# EAGLE design 5uH_LISN (EAGLE 7.6.0)
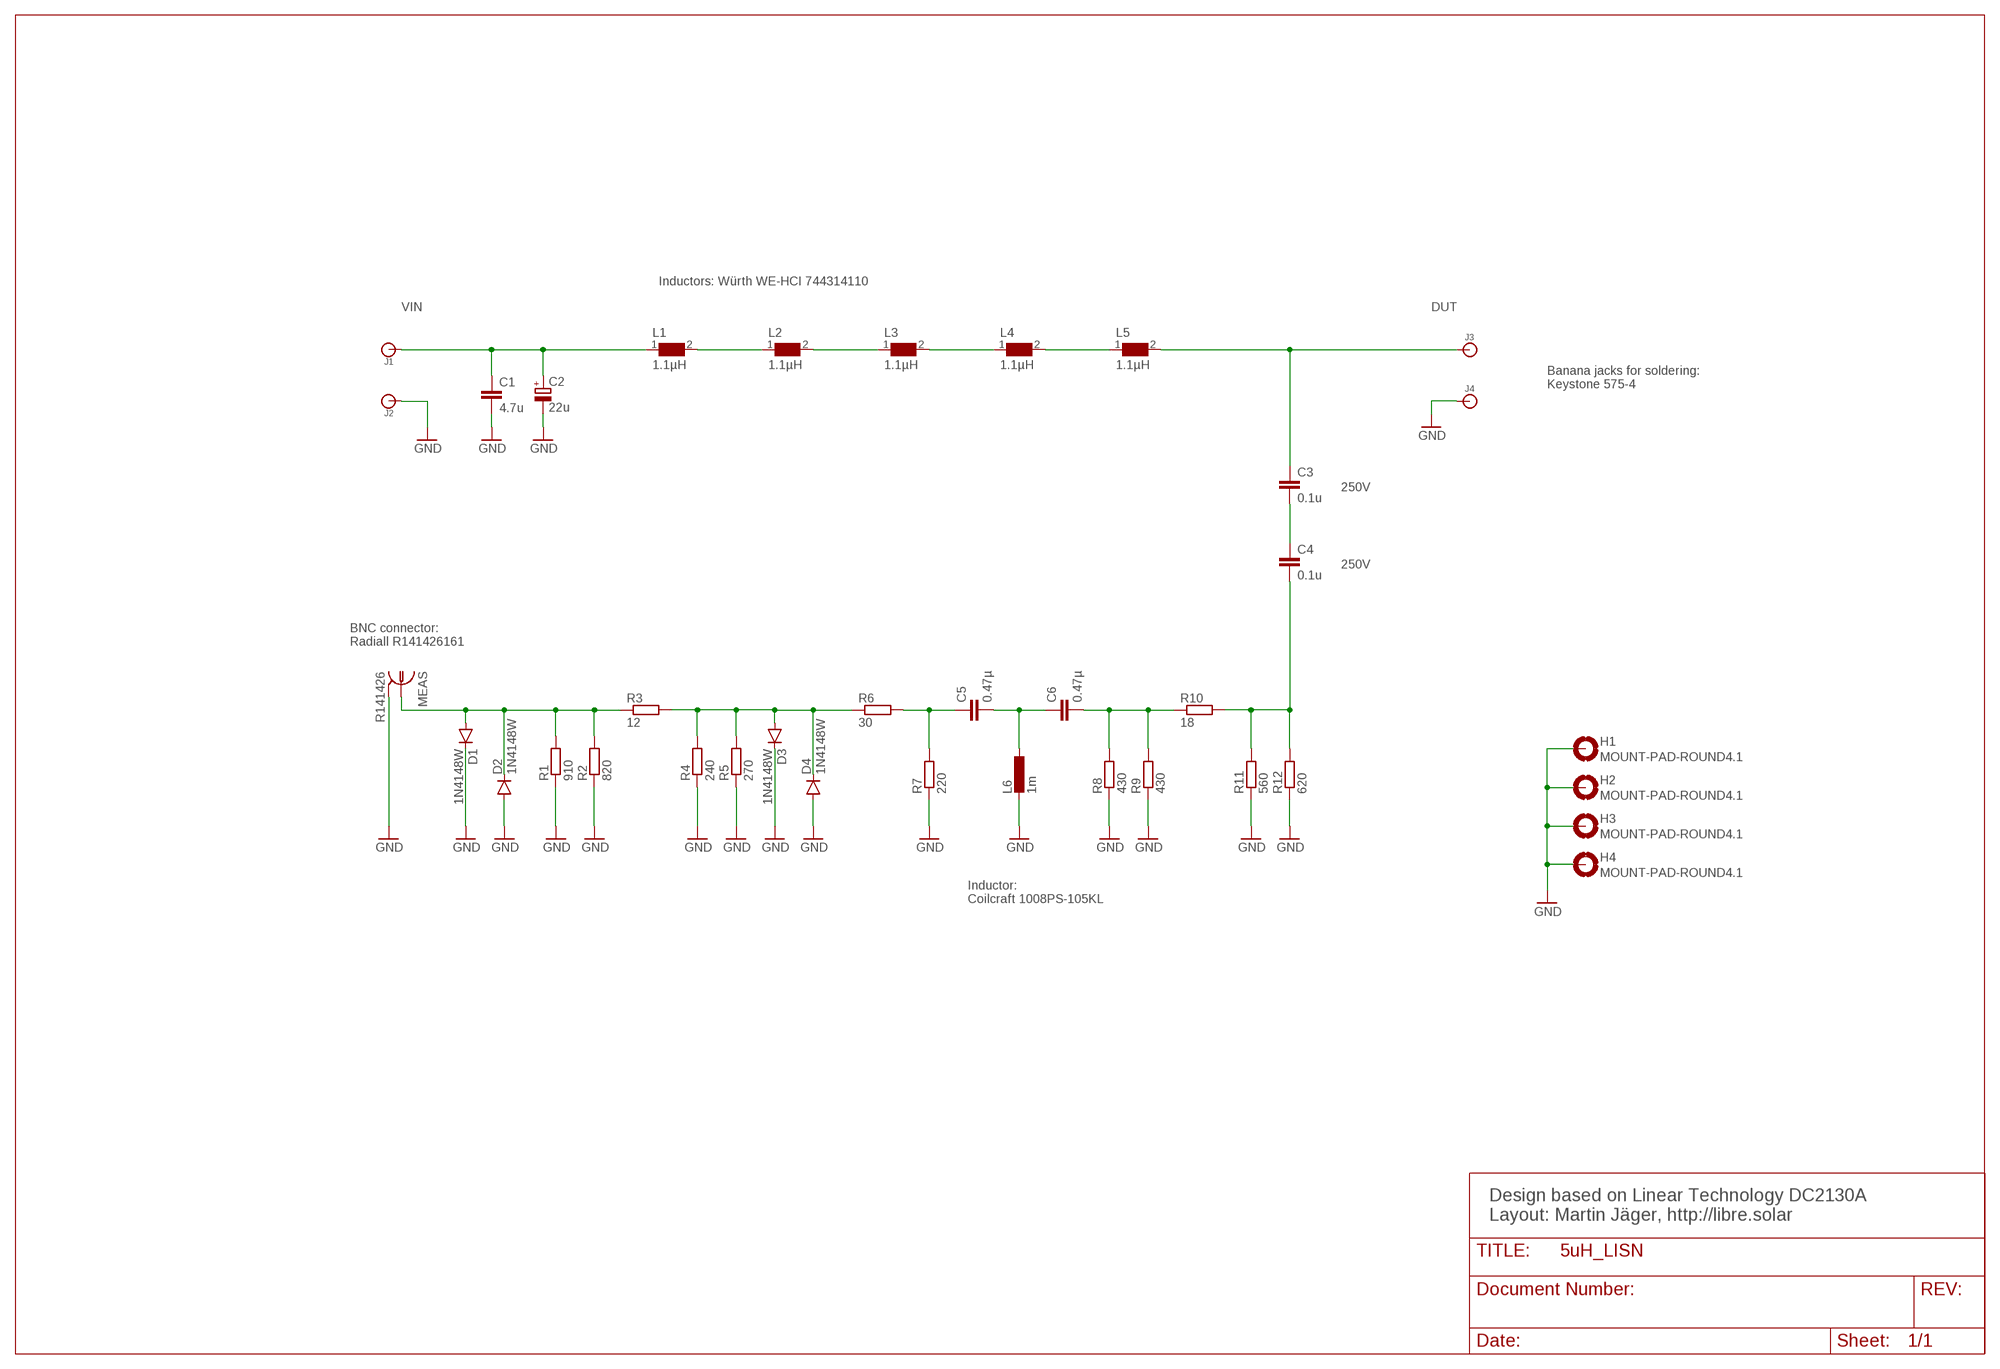
[diagram p0: schematic, sheet 1]

## Parts
C1  4.7u  C-EUC1210  [C1210]
C2  22u  CPOL-EUB  [PANASONIC_B]
C3  0.1u  C-EUC1206  [C1206]
C4  0.1u  C-EUC1206  [C1206]
C5  0.47µ  C-EUC0805  [C0805]
C6  0.47µ  C-EUC0805  [C0805]
D1  1N4148W  DIODESOD123  [SOD-123]
D2  1N4148W  DIODESOD123  [SOD-123]
D3  1N4148W  DIODESOD123  [SOD-123]
D4  1N4148W  DIODESOD123  [SOD-123]
H1  MOUNT-PAD-ROUND4.1  [4,1-PAD]
H2  MOUNT-PAD-ROUND4.1  [4,1-PAD]
H3  MOUNT-PAD-ROUND4.1  [4,1-PAD]
H4  MOUNT-PAD-ROUND4.1  [4,1-PAD]
J1  BANANA_CONN  [BANANA_CONN]
J2  BANANA_CONN  [BANANA_CONN]
J3  BANANA_CONN  [BANANA_CONN]
J4  BANANA_CONN  [BANANA_CONN]
L1  1.1µH  WE-HCI_7030/7040/7050  [WE-HCI_7030/7040/7050]
L2  1.1µH  WE-HCI_7030/7040/7050  [WE-HCI_7030/7040/7050]
L3  1.1µH  WE-HCI_7030/7040/7050  [WE-HCI_7030/7040/7050]
L4  1.1µH  WE-HCI_7030/7040/7050  [WE-HCI_7030/7040/7050]
L5  1.1µH  WE-HCI_7030/7040/7050  [WE-HCI_7030/7040/7050]
L6  1m  INDUCTOR  [COILCRAFT_1008PS]
MEAS  R141426  [R141426]
R1  910  R-EU_R0805  [R0805]
R2  820  R-EU_R0805  [R0805]
R3  12  R-EU_R0805  [R0805]
R4  240  R-EU_R0805  [R0805]
R5  270  R-EU_R0805  [R0805]
R6  30  R-EU_R0805  [R0805]
R7  220  R-EU_R0805  [R0805]
R8  430  R-EU_R0805  [R0805]
R9  430  R-EU_R0805  [R0805]
R10  18  R-EU_R0805  [R0805]
R11  560  R-EU_R0805  [R0805]
R12  620  R-EU_R0805  [R0805]

## Nets
GND: C1.2 C2.- D1.C D2.A D3.C D4.A H1.B4,1(MOUNT) H2.B4,1(MOUNT) H3.B4,1(MOUNT) H4.B4,1(MOUNT) J2.P$1 J4.P$1 L6.P$2 MEAS.2 MEAS.3 MEAS.4 MEAS.5 R1.1 R2.1 R4.1 R5.1 R7.1 R8.1 R9.1 R11.1 R12.1
N$1: C1.1 C2.+ J1.P$1 L1.1
N$2: L1.2 L2.1
N$3: L2.2 L3.1
N$4: L3.2 L4.1
N$5: L4.2 L5.1
N$6: C3.1 J3.P$1 L5.2
N$7: C3.2 C4.1
N$8: D1.A D2.C MEAS.1 R1.2 R2.2 R3.1
N$9: D3.A D4.C R3.2 R4.2 R5.2 R6.1
N$10: C5.1 R6.2 R7.2
N$11: C5.2 C6.1 L6.P$1
N$12: C6.2 R8.2 R9.2 R10.1
N$13: C4.2 R10.2 R11.2 R12.2

## Notes on the sheet
- Inductors: Würth WE-HCI 744314110
- VIN | DUT
- Banana jacks for soldering:
  Keystone 575-4
- 250V
- 250V
- BNC connector:
  Radiall R141426161
- Inductor:
  Coilcraft 1008PS-105KL
- Design based on Linear Technology DC2130A
  Layout: Martin Jäger, http://libre.solar

## Library data of the parts
C1 C3-C6 = rcl:C-EU: CAPACITOR, European symbol
C2 = rcl:CPOL-EU: POLARIZED CAPACITOR, European symbol
D1-D4 = SparkFun-DiscreteSemi:DIODE: Diode These are standard reverse protection diodes and small signal diodes. SMA package can handle up to about 1A. SOD-323 can handle about 200mA. What the SOD-323 package when ordering, there are some mfgs out there that are 5-pin packages.; MF: DIODES INC.; MPN: 1N4148W-7-F.; OC_FARNELL: 1776392
H1-H4 = holes:MOUNT-PAD-ROUND: MOUNTING PAD, round
J1-J4 = LibreSolar:BANANA_CONN: Through-hole banana jack
L1-L5 = PowerMagnetics:WE-HCI: SMD-Flat Wire High Current Inductor WE-HCI - Flat wire coil for lower losses at high frequency ranges - Low leakage field - Extremely low profile design - Current loading up to 40 A - Magnetically shielded -- Graphic cards -- Laptops -- Motherboards -- High current switching regulators -- Polyphase-switching regulators -- industrial computers <http://katalog.we-online.de/media/images/eisos/IndHCI_pf2.jpg> Details see: http://katalog.we-online.de/en/pbs/WE-HCI? Updated by Dan Xu 2014-07-07 2014 (C) Würth Elektronik
L6 = LibreSolar:INDUCTOR
MEAS = con-coax:R141426: BNC COAX CONNECTOR Radiall 50/75 Ohm Spoerle; MF: FARNELL; MPN: R141426161; OC_FARNELL: 4195115; OC_NEWARK: 14J7919
R1-R12 = rcl:R-EU_: RESISTOR, European symbol

## Net classes
0 default: width 0.203 mm, drill 0.5 mm, clearance 0.406 mm

## Board
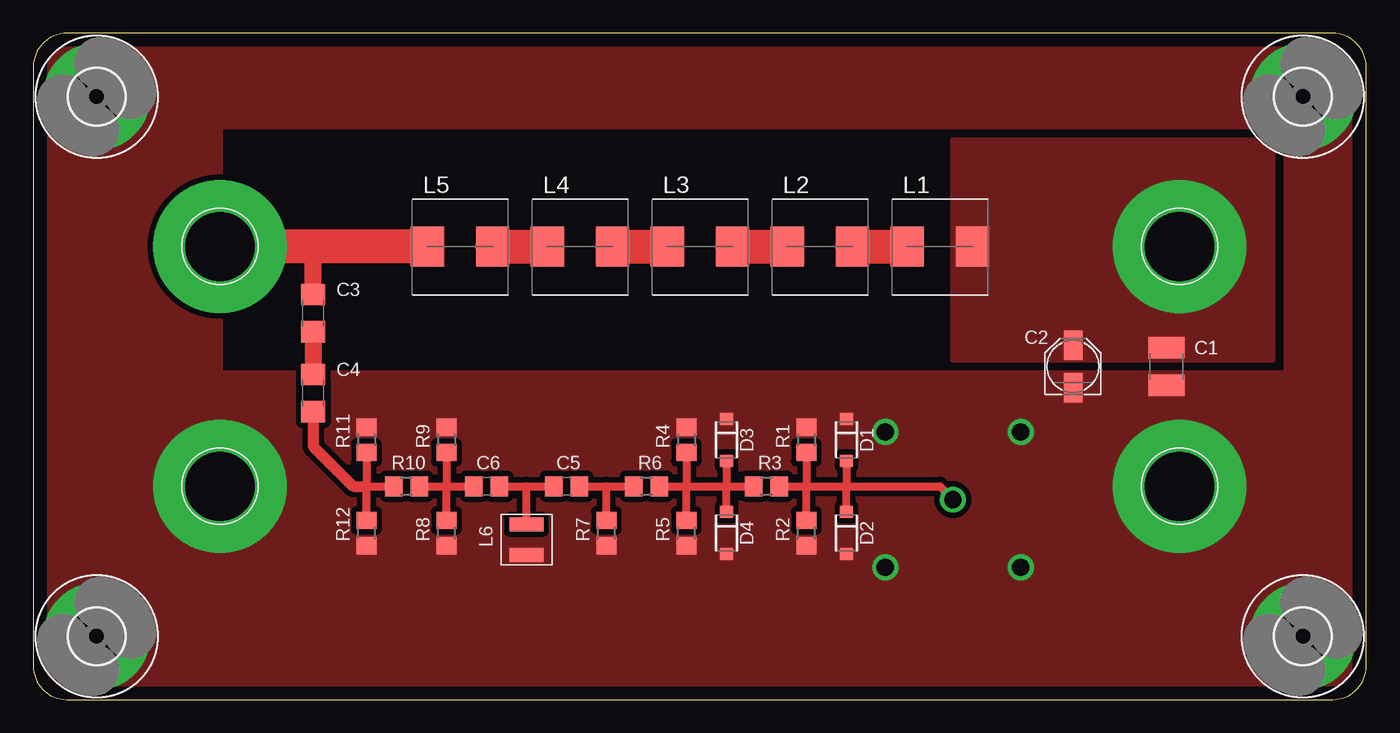
[diagram p1: board, top side]
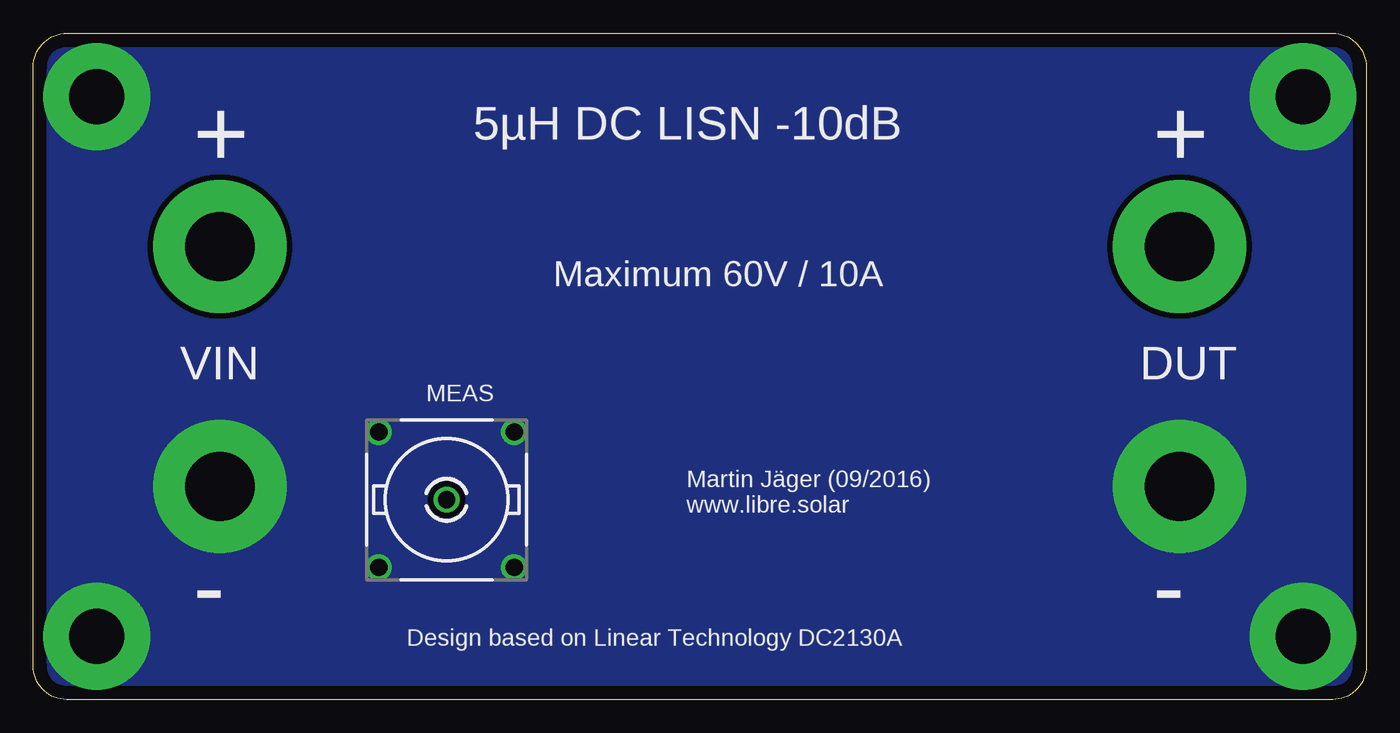
[diagram p2: board, bottom side, seen from below]

Size 100 x 50 mm. Coordinates in mm from the lower left corner, seen from the top.
Outline: 0,47.5 0,2.5 arc90 2.5,0 97.5,0 arc90 100,2.5 100,47.5 arc90 97.5,50 2.5,50 arc90 0,47.5
Copper layers (1*16): Top 0.035mm / dielectric 1.5mm / Bottom 0.035mm
Design rules "default": minimum track width 10mil, minimum drill 24mil, track to track 8mil, track to pad 8mil, pad to pad 8mil, via to via 8mil, smd to smd 8mil, copper to edge 40mil, drill to drill 8mil, minimum pad ring 10mil, minimum via ring 8mil, stop-mask expansion 4mil, vias tented up to drill 0mil, thermal gap 10mil
tRestrict: area 20,21 to 22,24

### Footprints (pad centres in the part's own frame; a part is rotated, then mirrored left to right if it is on the bottom)
C1210 = smd 1.6 x 2.7: 1 -1.4,0; 2 1.4,0
PANASONIC_B = smd 2.2 x 1.4: + 1.6,0; - -1.6,0
C1206 = smd 1.6 x 1.8: 1 -1.4,0; 2 1.4,0
C0805 = smd 1.3 x 1.5: 1 -0.95,0; 2 0.95,0
SOD-123 = smd 0.9 x 0.95: A 1.575,0; C -1.575,0
4,1-PAD = drill 4.1 pad 8: B4,1 0,0
BANANA_CONN = drill 5.2 pad 10: P$1 0,0
WE-HCI_7030/7040/7050 = smd 2.5 x 3: 1 -2.45,0; 2 2.45,0
COILCRAFT_1008PS = smd 2.54 x 1.016: P$1 0,1.143; P$2 0,-1.143
R141426 = drill 1.295: 1 0,0; 2 5.08,5.08; 3 -5.08,5.08; 4 -5.08,-5.08; 5 5.08,-5.08
R0805 = smd 1.3 x 1.5: 1 -0.95,0; 2 0.95,0

### Placement (x,y rotation side)
C1  85,25 270 top
C2  78,25 90 top
C3  21,29 270 top
C4  21,23 270 top
C5  40,16 180 top
C6  34,16 180 top
D1  61,19.5 270 top
D2  61,12.5 270 top
D3  52,19.5 270 top
D4  52,12.5 270 top
H1  4.75,45.25 0 top
H2  4.75,4.75 0 top
H3  95.25,45.25 0 top
H4  95.25,4.75 0 top
J1  86,34 0 top
J2  86,16 0 top
J3  14,34 0 top
J4  14,16 0 top
L1  68,34 180 top
L2  59,34 180 top
L3  50,34 180 top
L4  41,34 180 top
L5  32,34 180 top
L6  37,12 0 top
MEAS  69,15 0 bottom
R1  58,19.5 270 top
R2  58,12.5 90 top
R3  55,16 180 top
R4  49,19.5 270 top
R5  49,12.5 90 top
R6  46,16 180 top
R7  43,12.5 90 top
R8  31,12.5 90 top
R9  31,19.5 270 top
R10  28,16 180 top
R11  25,19.5 270 top
R12  25,12.5 90 top

### Tracks (layer width: path | path; a pad name or v marks a point on that pad's centre or on a via)
GND
  pour Top (no thermals): -1,51 14,51 14,24.5 94,24.5 94,51 101,51 101,-1 -1,-1
  pour Bottom (no thermals): -2,53 103,53 103,-2 -2,-2
  pour Top (no thermals): -2,52 103,52 103,43 -2,43
N$1
  pour Top (no thermals): 69,42 93,42 93,25.5 69,25.5
N$2
  Top 2.54: L2.1 L1.2
N$3
  Top 2.54: L3.1 L2.2
N$4
  Top 2.54: L4.1 L3.2
N$5
  Top 2.54: L5.1 L4.2
N$6
  Top 1.27: C3.1 21,34
  Top 2.54: L5.2 21,34 J3.P$1
N$7
  Top 1.27: C3.2 C4.1
N$8
  Top 0.61: R3.1 58,16 | 58,16 61,16 | 61,16 68,16 MEAS.1 | R2.2 58,16 | R1.2 58,16 | D1.A 61,16 | D2.C 61,16
N$9
  Top 0.61: R6.1 49,16 | 49,16 52,16 | 52,16 R3.2 | R5.2 49,16 | R4.2 49,16 | D3.A 52,16 | D4.C 52,16
N$10
  Top 0.61: C5.1 43,16 | 43,16 R6.2 | R7.2 43,16
N$11
  Top 0.61: C6.1 37,16 | 37,16 C5.2 | L6.P$1 37,16
N$12
  Top 0.61: R10.1 31,16 | 31,16 C6.2 | R8.2 31,16 | R9.2 31,16
N$13
  Top 0.61: 25,16 R10.2 | R11.2 25,16 | R12.2 25,16
  Top 0.813: C4.2 21,19 24,16 25,16

### Text on the board
bNames: 5µH DC LISN -10dB | + | + | Maximum 60V / 10A | DUT | VIN | Martin Jäger (09/2016) / www.libre.solar | - | - | Design based on Linear Technology DC2130A
tDocu: Housing: Hammond Mfg 1590G